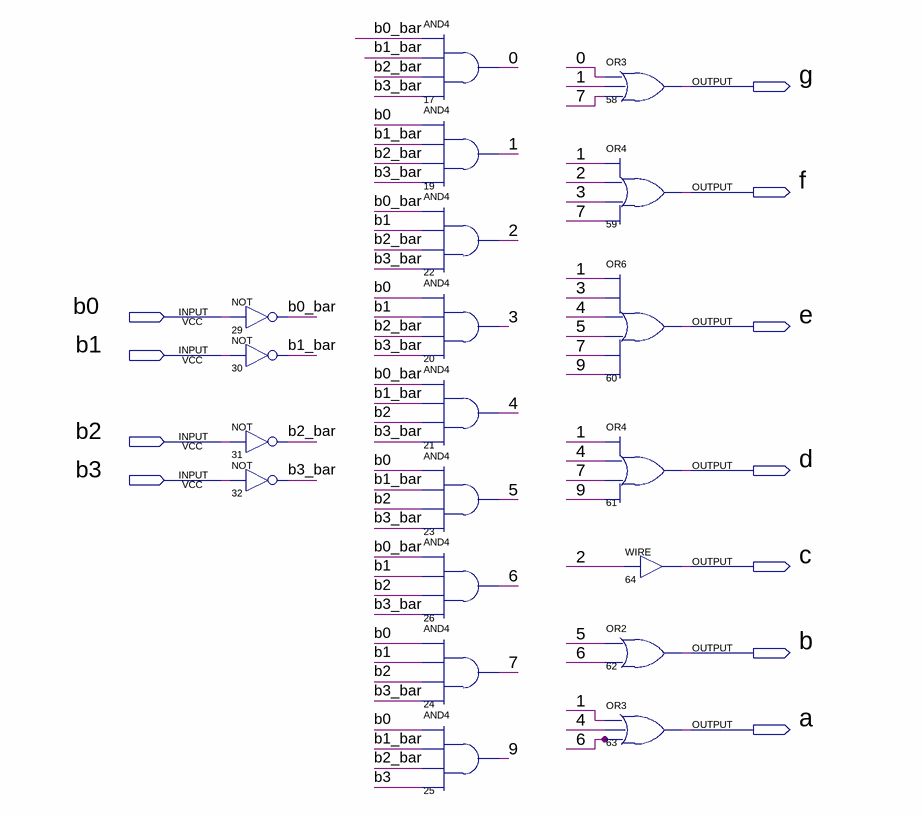
[diagram p0: schematic sheet]
// Quartus schematic BCD_7seg_A-1.bdf as structural Verilog: 20 symbols, 11 pins
module \BCD_7seg_A-1  (
  input  b0,
  input  b1,
  input  b2,
  input  b3,
  output g,
  output f,
  output e,
  output d,
  output c,
  output b,
  output a
);

  wire \0 , \1 , \2 , \3 , \4 , \5 , \6 , \7 , \9 , b0_bar, b1_bar, b2_bar, b3_bar;

  not u_29 (b0_bar, b0);
  not u_30 (b1_bar, b1);
  not u_31 (b2_bar, b2);
  not u_32 (b3_bar, b3);
  and u_17 (\0 , b0_bar, b1_bar, b2_bar, b3_bar);
  and u_19 (\1 , b0, b1_bar, b2_bar, b3_bar);
  and u_22 (\2 , b0_bar, b1, b2_bar, b3_bar);
  and u_20 (\3 , b0, b1, b2_bar, b3_bar);
  and u_21 (\4 , b0_bar, b1_bar, b2, b3_bar);
  and u_23 (\5 , b0, b1_bar, b2, b3_bar);
  and u_26 (\6 , b0_bar, b1, b2, b3_bar);
  and u_24 (\7 , b0, b1, b2, b3_bar);
  and u_25 (\9 , b0, b1_bar, b2_bar, b3);
  or u_58 (g, \0 , \1 , \7 );
  or u_59 (f, \1 , \2 , \3 , \7 );
  or u_60 (e, \1 , \3 , \4 , \5 , \7 , \9 );
  or u_61 (d, \1 , \4 , \7 , \9 );
  assign c = \2 ;  // WIRE 64
  or u_62 (b, \5 , \6 );
  or u_63 (a, \1 , \4 , \6 );
endmodule
